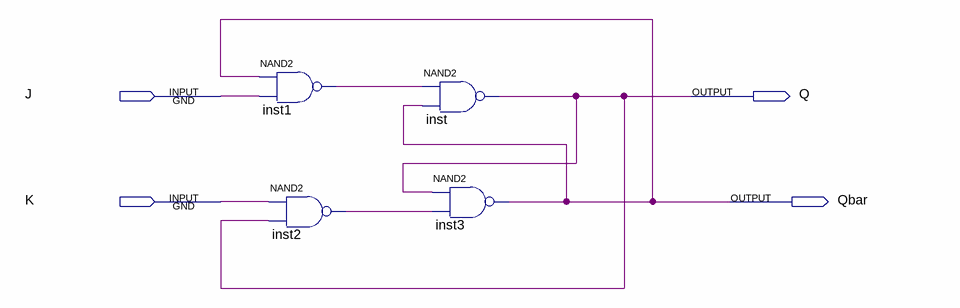
[diagram p0: schematic sheet]
// Quartus schematic JK_Latch.bdf as structural Verilog: 4 symbols, 4 pins
module JK_Latch (
  input  J,
  input  K,
  output Q,
  output Qbar
);

  wire inst1_out, inst2_out;

  nand inst1 (inst1_out, Qbar, J);
  nand inst2 (inst2_out, K, Q);
  nand inst (Q, inst1_out, Qbar);
  nand inst3 (Qbar, Q, inst2_out);
endmodule
